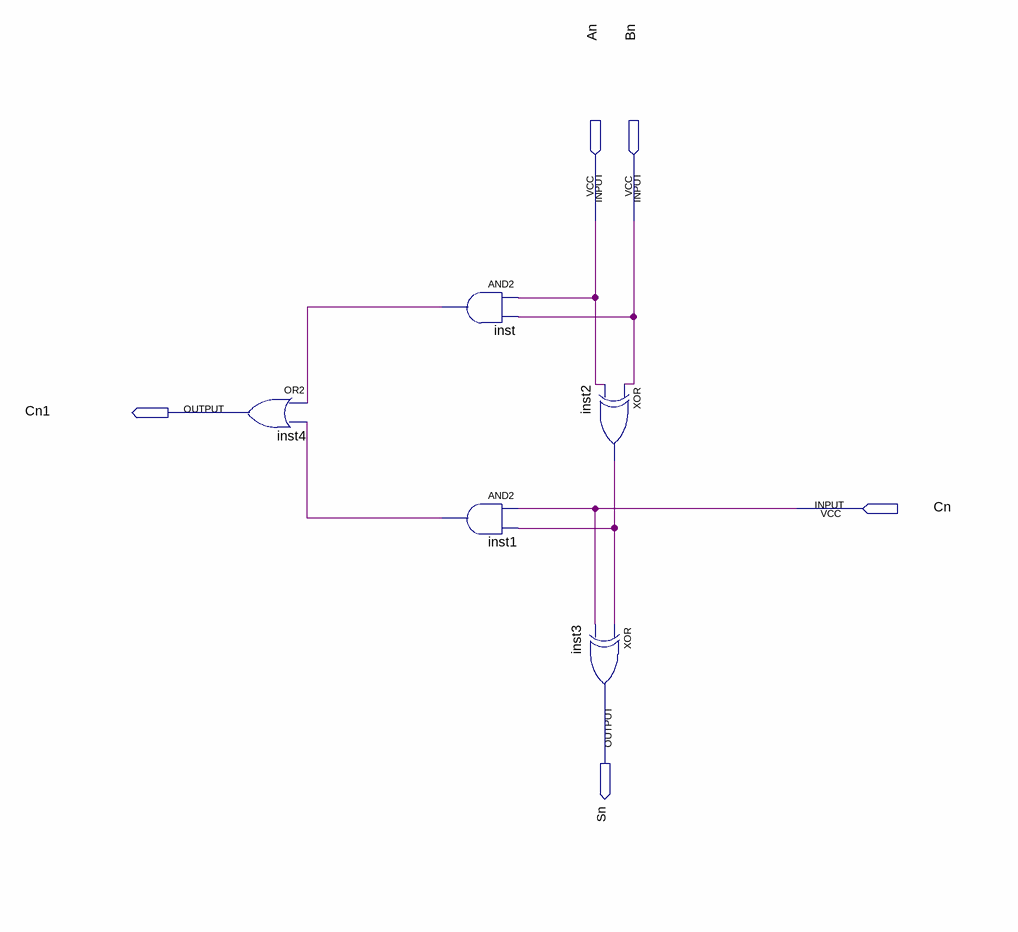
[diagram p0: schematic sheet]
// Quartus schematic somador_1_bit.bdf as structural Verilog: 5 symbols, 5 pins
module somador_1_bit (
  input  An,
  input  Bn,
  input  Cn,
  output Cn1,
  output Sn
);

  wire inst1_out, inst2_out, inst_out;

  or inst4 (Cn1, inst_out, inst1_out);
  and inst (inst_out, An, Bn);
  and inst1 (inst1_out, Cn, inst2_out);
  xor inst2 (inst2_out, Bn, An);
  xor inst3 (Sn, inst2_out, Cn);
endmodule
